# Altium project VM02_hv3.PrjPcb
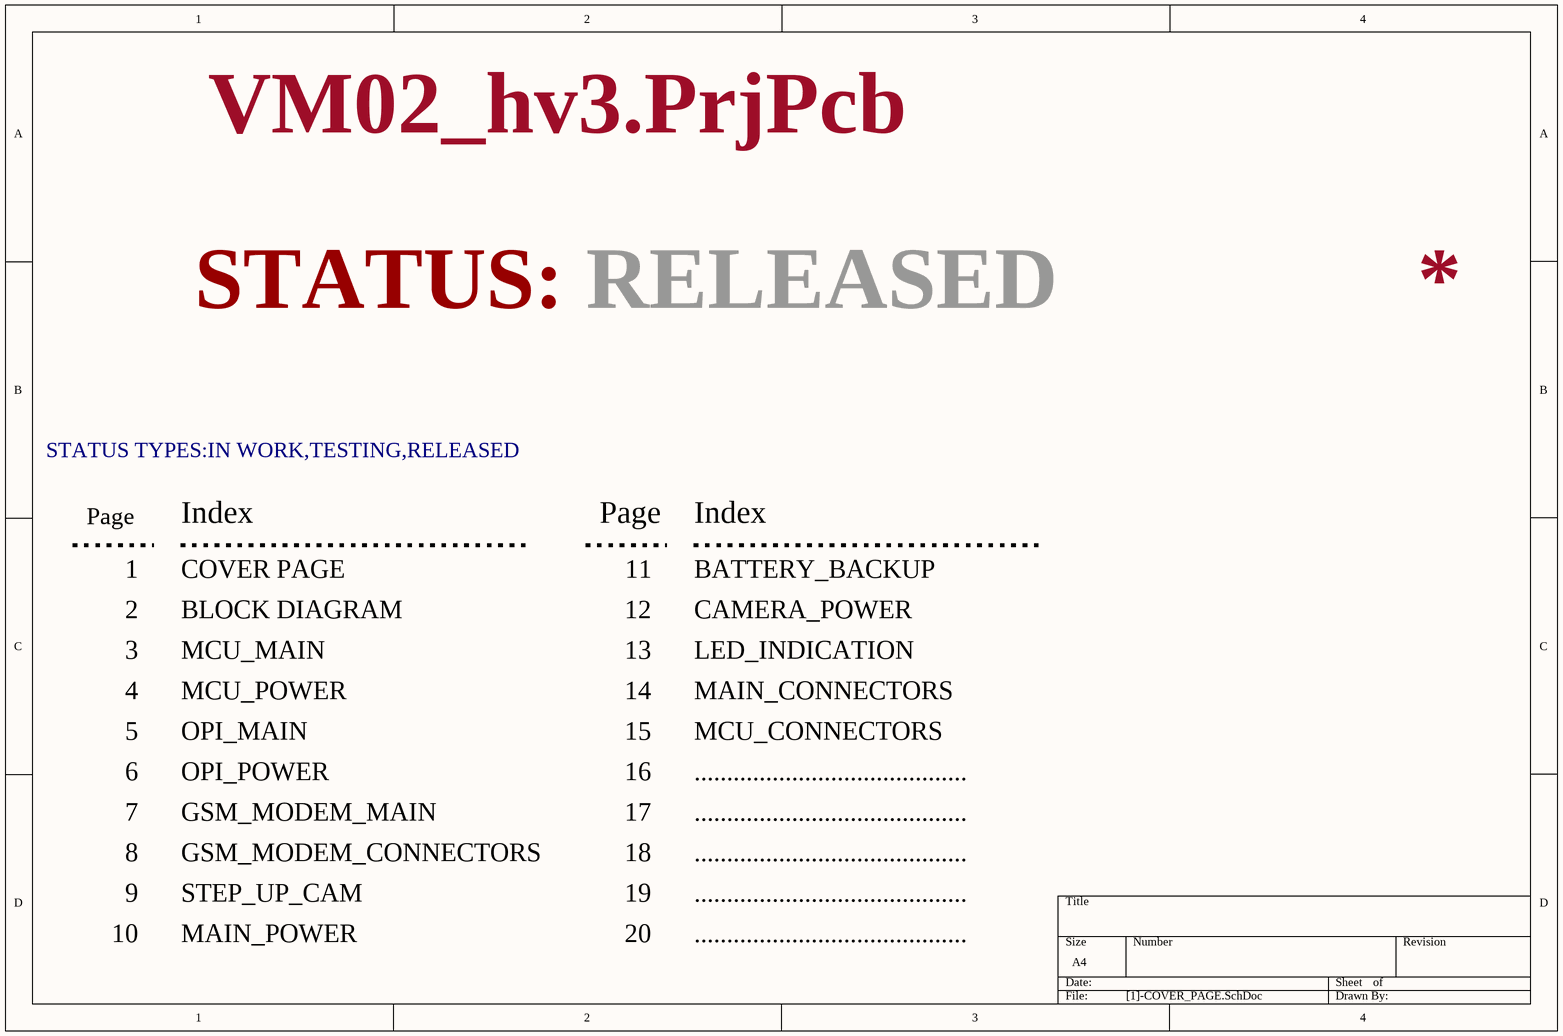
[diagram p0: [1]-COVER_PAGE.SchDoc]
10 sheets, 120 parts. Net scope: flat (ports and power ports of the same name join across sheets).
Board file: VM02_hv3.PcbDoc
Sheets:
  [1]-COVER_PAGE.SchDoc
  [2]-BLOCK_DIAGRAM.SchDoc
  [3]-MCU_MAIN.SchDoc
  [5]-OPI_MAIN.SchDoc
  [6]-OPI_POWER.SchDoc
  [10]-MAIN_POWER.SchDoc
  [12]-MCU_INPUTS.SchDoc
  [13]-LED_INDICATION.SchDoc
  [14]-MAIN_CONNECTORS.SchDoc
  [16]-CLOCK.SchDoc

## Sheet [1]-COVER_PAGE.SchDoc
size A4

### Notes on the sheet
- STATUS:
- RELEASED
- STATUS TYPES:IN WORK,TESTING,RELEASED
- Page
- 1
- Index
- COVER PAGE
- 11
- BATTERY_BACKUP
- 2
- BLOCK DIAGRAM
- 12
- CAMERA_POWER
- 3
- 4
- MCU_MAIN
- MCU_POWER
- 13
- 14
- LED_INDICATION
- MAIN_CONNECTORS
- 5
- 6
- OPI_MAIN
- OPI_POWER
- 15
- 16
- MCU_CONNECTORS
- ..........................................
- 7
- GSM_MODEM_MAIN
- 17
- 8
- 9
- GSM_MODEM_CONNECTORS
- STEP_UP_CAM
- 18
- 19
- 10
- MAIN_POWER
- 20

## Sheet [2]-BLOCK_DIAGRAM.SchDoc
size A4
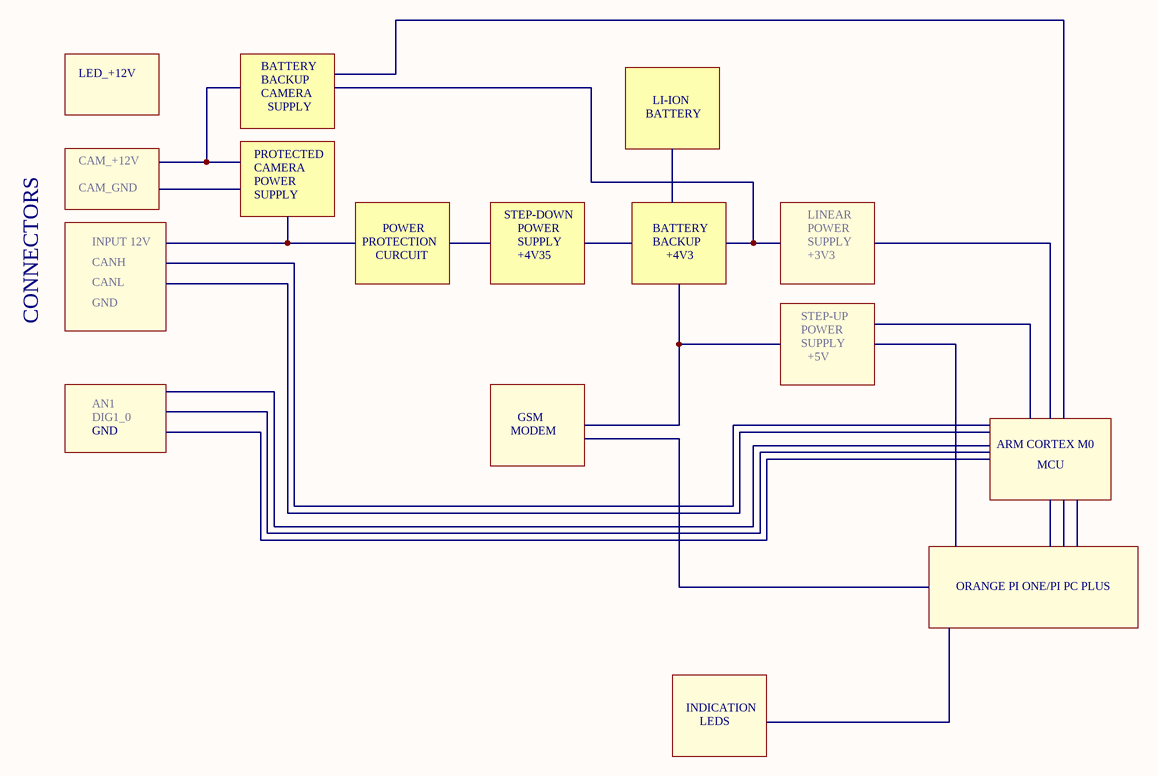
[diagram p1: [2]-BLOCK_DIAGRAM.SchDoc]

### Notes on the sheet
- LED_+12V
- BATTERY
- BACKUP
- CAMERA
- LI-ION
- CAM_+12V
- PROTECTED
- SUPPLY
- CAM_GND
- POWER
- STEP-DOWN
- LINEAR
- INPUT 12V
- CANH
- CANL
- PROTECTION
- CURCUIT
- +4V35
- +4V3
- +3V3
- CONNECTORS
- GND
- STEP-UP
- +5V
- AN1
- DIG1_0
- MODEM
- GSM
- ARM CORTEX M0
- MCU
- ORANGE PI ONE/PI PC PLUS
- INDICATION
- LEDS

## Sheet [3]-MCU_MAIN.SchDoc
size A4
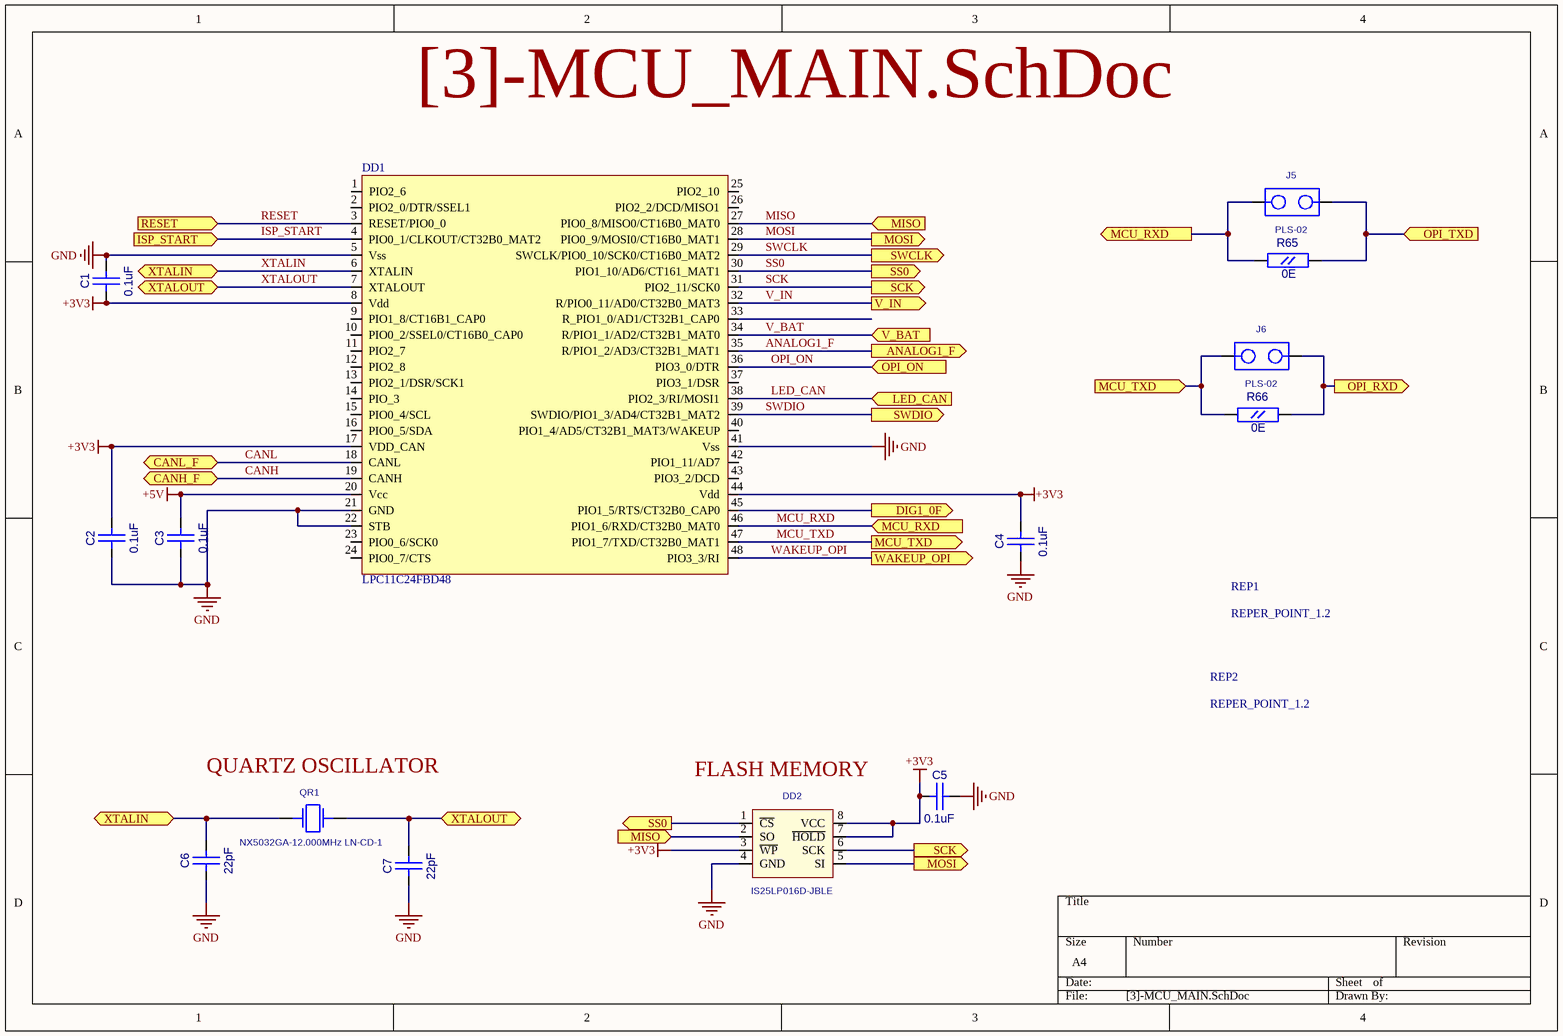
[diagram p2: [3]-MCU_MAIN.SchDoc]

### Parts
C1  0.1uF  [CC0603]
C2  0.1uF  [CC0603]
C3  0.1uF  [CC0603]
C4  0.1uF  [CC0603]
C5  0.1uF  [CC0603]
C6  22pF  [CC0603]
C7  22pF  [CC0603]
DD1  LPC11C24FBD48  [LQFP48]
DD2  IS25LP016D-JBLE  [EIAJ_SO8]
J5  PLS-02  [PLS-02]
J6  PLS-02  [PLS-02]
QR1  NX5032GA-12.000MHz LN-CD-1  [AC5032_2]
R65  0E  [RC0603]
R66  0E  [RC0603]
REP1  REPER_POINT_1.2  [REPER1.2]
REP2  REPER_POINT_1.2  [REPER1.2]

### Ports
ANALOG1_F (out), CANH_F (bidir), CANL_F (bidir), DIG1_0F (out), ISP_START (in), LED_CAN (in), MCU_RXD (in), MCU_RXD (out), MCU_TXD (in), MCU_TXD (out), MISO (in), MOSI (out), OPI_ON (in), OPI_RXD (out), OPI_TXD (in), RESET (in), SCK (out), SS0 (out), SWCLK (out), SWDIO (out), V_BAT (in), V_IN (out), WAKEUP_OPI (out), XTALIN (bidir), XTALOUT (bidir)

### Nets
+3V3: C1.1(A) C2.2(B) C4.2(B) C5.1(A) DD1.8(Vdd) DD1.17(VDD_CAN) DD1.44(Vdd) DD2.3(~{WP}) DD2.7(~{HOLD}) DD2.8(VCC)
+5V: C3.2(B) DD1.20(Vcc)
GND: C1.2(B) C2.1(A) C3.1(A) C4.1(A) C5.2(B) C6.1(A) C7.1(A) DD1.5(Vss) DD1.21(GND) DD1.22(STB) DD1.41(Vss) DD2.4(GND)
ANALOG1_F: DD1.35(R/PIO1_2/AD3/CT32B1_MAT1) ; port ANALOG1_F
CANH: DD1.19(CANH) ; port CANH_F
CANL: DD1.18(CANL) ; port CANL_F
ISP_START: DD1.4(PIO0_1/CLKOUT/CT32B0_MAT2) ; port ISP_START
LED_CAN: DD1.38(PIO2_3/RI/MOSI1) ; port LED_CAN
MCU_RXD: DD1.46(PIO1_6/RXD/CT32B0_MAT0) J5.1 R65.1(A) ; port MCU_RXD
MCU_TXD: DD1.47(PIO1_7/TXD/CT32B0_MAT1) J6.1 R66.1(A) ; port MCU_TXD
MISO: DD1.27(PIO0_8/MISO0/CT16B0_MAT0) DD2.2(SO) ; port MISO
MOSI: DD1.28(PIO0_9/MOSI0/CT16B0_MAT1) DD2.5(SI) ; port MOSI
OPI_ON: DD1.36(PIO3_0/DTR) ; port OPI_ON
RESET: DD1.3(RESET/PIO0_0) ; port RESET
SCK: DD1.31(PIO2_11/SCK0) DD2.6(SCK) ; port SCK
SS0: DD1.30(PIO1_10/AD6/CT161_MAT1) DD2.1(~{CS}) ; port SS0
SWCLK: DD1.29(SWCLK/PIO0_10/SCK0/CT16B0_MAT2) ; port SWCLK
SWDIO: DD1.39(SWDIO/PIO1_3/AD4/CT32B1_MAT2) ; port SWDIO
V_BAT: DD1.34(R/PIO1_1/AD2/CT32B1_MAT0) ; port V_BAT
V_IN: DD1.32(R/PIO0_11/AD0/CT32B0_MAT3) ; port V_IN
WAKEUP_OPI: DD1.48(PIO3_3/RI) ; port WAKEUP_OPI
XTALIN: C6.2(B) DD1.6(XTALIN) QR1.1 ; port XTALIN
XTALOUT: C7.2(B) DD1.7(XTALOUT) QR1.2 ; port XTALOUT
NetC52_2: DD1.45(PIO1_5/RTS/CT32B0_CAP0) ; port DIG1_0F
NetJ5_2: J5.2 R65.2(B) ; port OPI_TXD
NetJ6_2: J6.2 R66.2(B) ; port OPI_RXD

Not connected (* = marked no-connect by the designer): DD1 1(PIO2_6) 2(PIO2_0/DTR/SSEL1) 9(PIO1_8/CT16B1_CAP0) 10(PIO0_2/SSEL0/CT16B0_CAP0) 11(PIO2_7) 12(PIO2_8) 13(PIO2_1/DSR/SCK1) 14(PIO_3) 15(PIO0_4/SCL) 16(PIO0_5/SDA) 23(PIO0_6/SCK0) 24(PIO0_7/CTS) 25(PIO2_10) 26(PIO2_2/DCD/MISO1) 33(R_PIO1_0/AD1/CT32B1_CAP0) 37(PIO3_1/DSR) 40(PIO1_4/AD5/CT32B1_MAT3/WAKEUP) 42(PIO1_11/AD7) 43(PIO3_2/DCD); REP1 1; REP2 1

### Notes on the sheet
- (near QR1) QUARTZ OSCILLATOR
- (near DD2) FLASH MEMORY

### Library data of the parts
C1-C7 = CC0603
  C1-C5: Value: 0.1uF
  C6 C7: Value: 22pF
DD2 = S25FL016A0LMFI01: Value: IS25LP016D-JBLE
QR1 = AC5032_2: AC5032/2; Value: NX5032GA-12.000MHz LN-CD-1
R65 R66 = RC0603: Value: 0E
REP1 REP2 = REPER1.2: Value: REPER_POINT_1.2
DD1 = LPC11C24FBD48: Value: LPC11C24FBD48
J5 J6 = PLS-02: Value: *

## Sheet [5]-OPI_MAIN.SchDoc
size A4
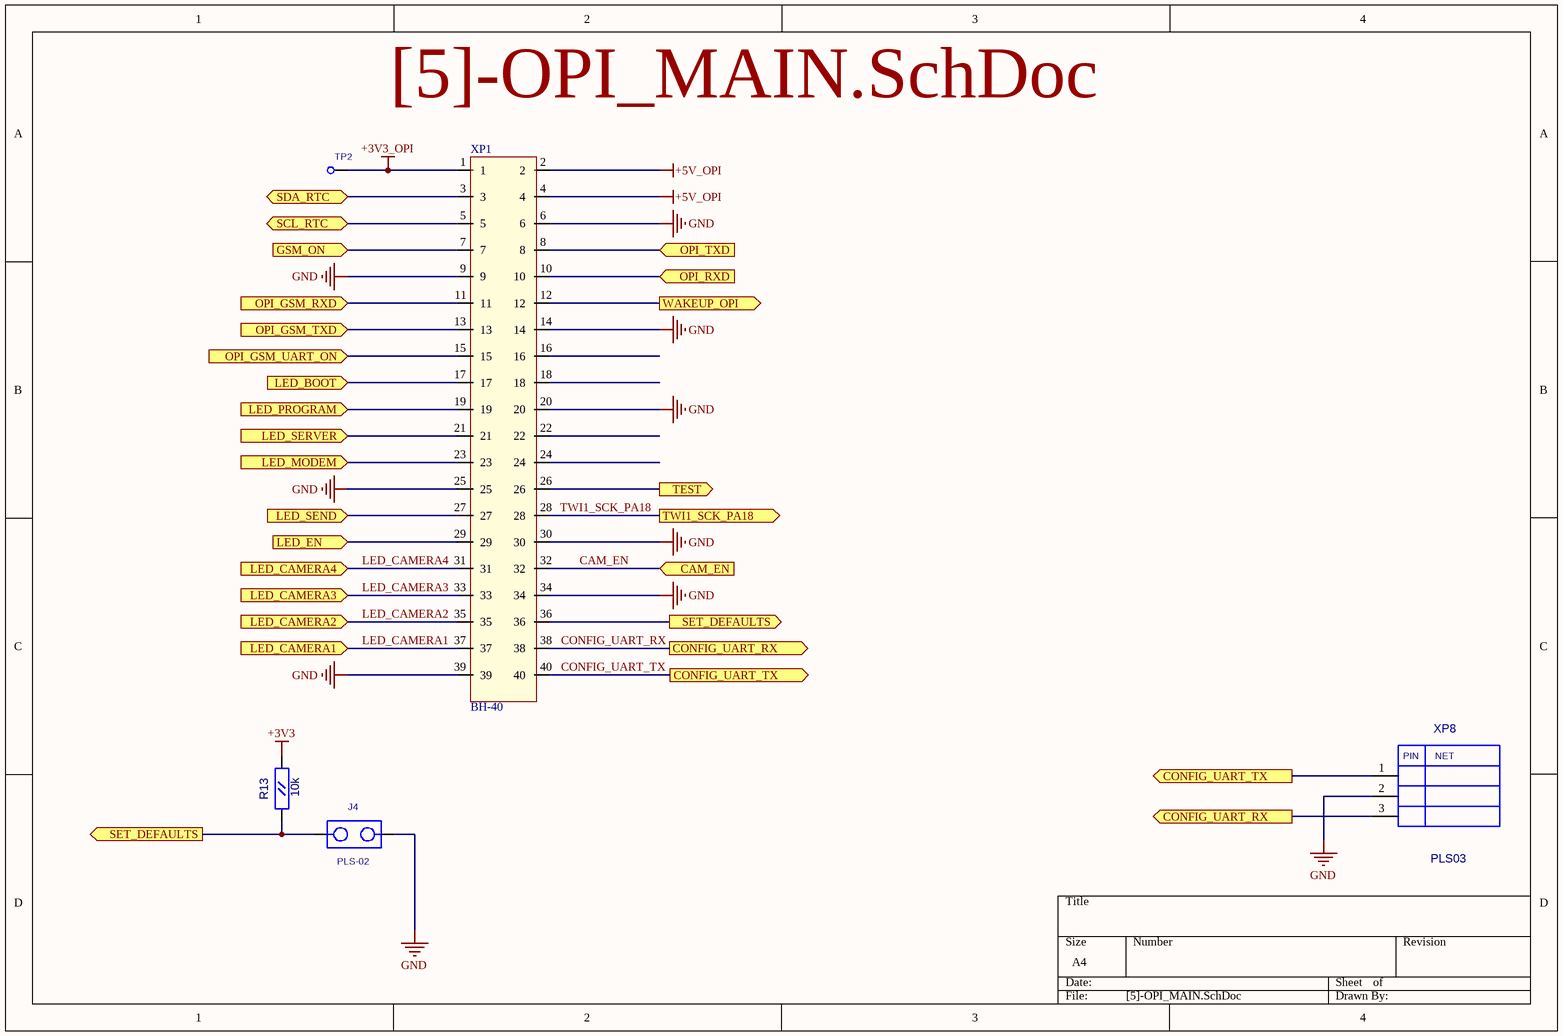
[diagram p3: [5]-OPI_MAIN.SchDoc]

### Parts
J4  PLS-02  [PLS-02]
R13  10k  [RC0603]
TP2  TESTPOINT1  [TESTPOINT1]  (value not drawn)
XP1  BH-40  [BH-40]
XP8  PLS03  [PLS-03]

### Ports
CAM_EN (in), CONFIG_UART_RX (out), CONFIG_UART_TX (out), GSM_ON (in), LED_BOOT (in), LED_CAMERA1 (in), LED_CAMERA2 (in), LED_CAMERA3 (in), LED_CAMERA4 (in), LED_EN (in), LED_MODEM (in), LED_PROGRAM (in), LED_SEND (in), LED_SERVER (in), OPI_GSM_RXD (in), OPI_GSM_TXD (in), OPI_GSM_UART_ON (in), OPI_RXD (in), OPI_TXD (in), SCL_RTC (bidir), SDA_RTC (bidir), SET_DEFAULTS (out), TEST (out), TWI1_SCK_PA18 (out), WAKEUP_OPI (out)

### Nets
+3V3: R13.2(B)
+3V3_OPI: TP2.1 XP1.1
+5V_OPI: XP1.2 XP1.4
GND: J4.2 XP1.6 XP1.9 XP1.14 XP1.20 XP1.25 XP1.30 XP1.34 XP1.39 XP8.2
CAM_EN: XP1.32 ; port CAM_EN
CONFIG_UART_RX: XP1.38 XP8.3 ; port CONFIG_UART_RX
CONFIG_UART_TX: XP1.40 XP8.1 ; port CONFIG_UART_TX
LED_CAMERA1: XP1.37 ; port LED_CAMERA1
LED_CAMERA2: XP1.35 ; port LED_CAMERA2
LED_CAMERA3: XP1.33 ; port LED_CAMERA3
LED_CAMERA4: XP1.31 ; port LED_CAMERA4
TWI1_SCK_PA18: XP1.28 ; port TWI1_SCK_PA18
WAKEUP_OPI: XP1.12 ; port WAKEUP_OPI
NetDD5_5: XP1.3 ; port SDA_RTC
NetDD5_6: XP1.5 ; port SCL_RTC
NetJ4_1: J4.1 R13.1(A) XP1.36 ; port SET_DEFAULTS
NetJ5_2: XP1.8 ; port OPI_TXD
NetJ6_2: XP1.10 ; port OPI_RXD
NetR49_2: XP1.17 ; port LED_BOOT
NetR50_2: XP1.23 ; port LED_MODEM
NetR51_2: XP1.19 ; port LED_PROGRAM
NetR52_2: XP1.21 ; port LED_SERVER
NetR64_2: XP1.27 ; port LED_SEND
NetXP1_7: XP1.7 ; port GSM_ON
NetXP1_11: XP1.11 ; port OPI_GSM_RXD
NetXP1_13: XP1.13 ; port OPI_GSM_TXD
NetXP1_15: XP1.15 ; port OPI_GSM_UART_ON
NetXP1_26: XP1.26 ; port TEST
NetXP1_29: XP1.29 ; port LED_EN

Not connected (* = marked no-connect by the designer): XP1 16 18 22 24

### Notes on the sheet
- (in symbol PLS03) PIN; NET

### Library data of the parts
R13 = RC0603: Value: 10k
XP1 = BH-40: 2.54mm connector with key; Value: BH-40
J4 = PLS-02: Value: *
TP2 = TESTPOINT1: Value: *
XP8 = PLS03: Value: *

## Sheet [6]-OPI_POWER.SchDoc
size A4
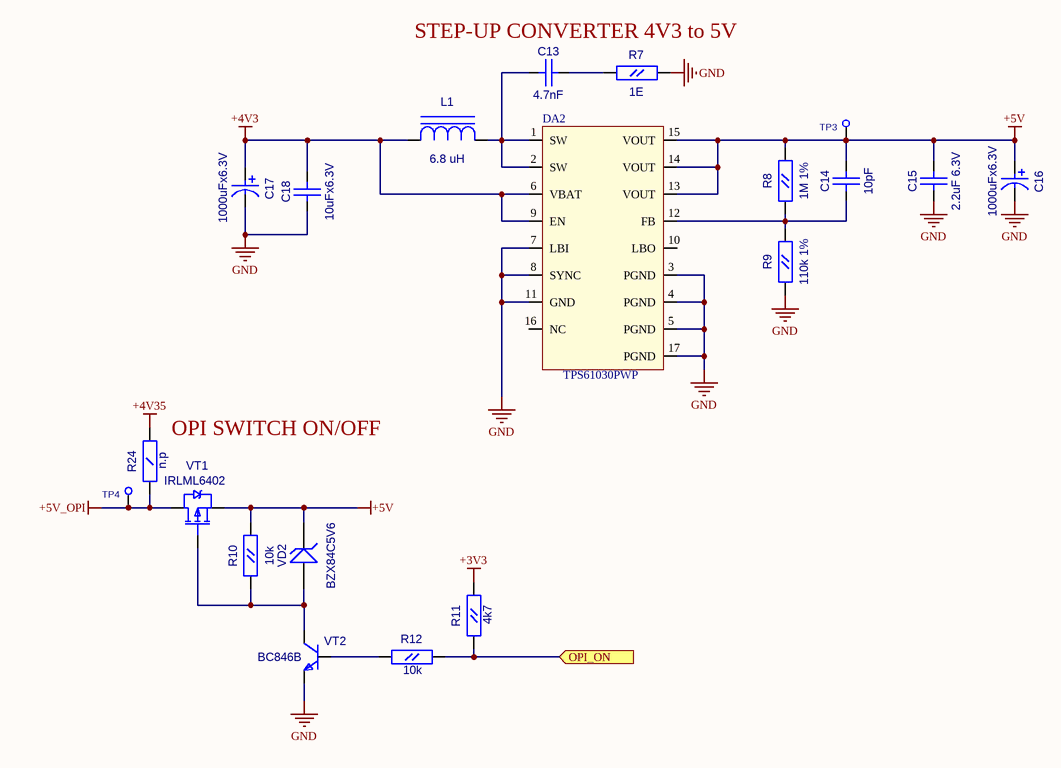
[diagram p4: [6]-OPI_POWER.SchDoc]

### Parts
C13  4.7nF  [CC0603]
C14  10pF  [CC0603]
C15  2.2uF 6.3V  [CC0805]
C16  value 1000uFx6.3V  [CC8X3.5]  (hidden comment: CAP0.35)
C17  value 1000uFx6.3V  [CC8X3.5]  (hidden comment: CAP0.35)
C18  10uFx6.3V  [CC0805]
DA2  TPS61030PWP  [R-PDSO-G16]
L1  6.8 uH  [SDR0805]
R7  1E  [RC0603]
R8  1M 1%  [RC0603]
R9  110k 1%  [RC0603]
R10  10k  [RC0603]
R11  4k7  [RC0603]
R12  10k  [RC0603]
R24  n.p  [RC1206]
TP3  TESTPOINT1  [TESTPOINT1]  (value not drawn)
TP4  TESTPOINT1  [TESTPOINT1]  (value not drawn)
VD2  BZX84C5V6  [SOT-23(123)]
VT1  IRLML6402  [SOT-23(123)]
VT2  BC846B  [SOT-23(123)]

### Ports
OPI_ON (in)

### Nets
+3V3: R11.2(B)
+4V3: C17.1 C18.2(B) DA2.6(VBAT) DA2.9(EN) L1.1(C)
+4V35: R24.2(B)
+5V: C14.2(B) C15.2(B) C16.1 DA2.13(VOUT) DA2.14(VOUT) DA2.15(VOUT) R8.2(B) R10.2(B) TP3.1 VD2.3(K) VT1.2(S)
+5V_OPI: R24.1(A) TP4.1 VT1.3(D)
GND: C15.1(A) C16.2 C17.2 C18.1(A) DA2.3(PGND) DA2.4(PGND) DA2.5(PGND) DA2.7(LBI) DA2.8(SYNC) DA2.11(GND) DA2.17(PGND) R7.2(B) R9.1(A) VT2.2(E)
OPI_ON: R11.1(A) R12.2(B) ; port OPI_ON
NetC13_1: C13.1(A) DA2.1(SW) DA2.2(SW) L1.2(A)
NetC13_2: C13.2(B) R7.1(A)
NetC14_1: C14.1(A) DA2.12(FB) R8.1(A) R9.2(B)
NetR10_1: R10.1(A) VD2.1(A) VT1.1(G) VT2.3(C)
NetR12_1: R12.1(A) VT2.1(B)

Not connected (* = marked no-connect by the designer): DA2 10(LBO) 16(NC)

### Notes on the sheet
- STEP-UP CONVERTER 4V3 to 5V
- (near R24) OPI SWITCH ON/OFF

### Library data of the parts
C13 C14 = CC0603
  C13: Value: 4.7nF
  C14: Value: 10pF
C15 C18 = CC0805
  C15: Value: 2.2uF 6.3V
  C18: Value: 10uFx6.3V
DA2 = TPS61030PWP: Boost converter
L1 = SDR0805: Value: 6.8 uH
R7-R12 = RC0603
  R7: Value: 1E
  R8: Value: 1M 1%
  R9: Value: 110k 1%
  R10 R12: Value: 10k
  R11: Value: 4k7
R24 = RC1206: Value: n.p
VD2 = BZX84: Zener Voltage Regulator Diode; Value: BZX84C5V6
VT1 = IRLML6402: HEXFET Power MOSFET; OriginalName: IRLML5103; ComponentField7: Published 8-Jun-2000; Value: IRLML6402
VT2 = BC846BLT1: ComponentField7: Published 29-Sep-2000; OriginalName: BC846BLT1; Value: BC846B
TP3 TP4 = TESTPOINT1: Value: *

## Sheet [10]-MAIN_POWER.SchDoc
size A4
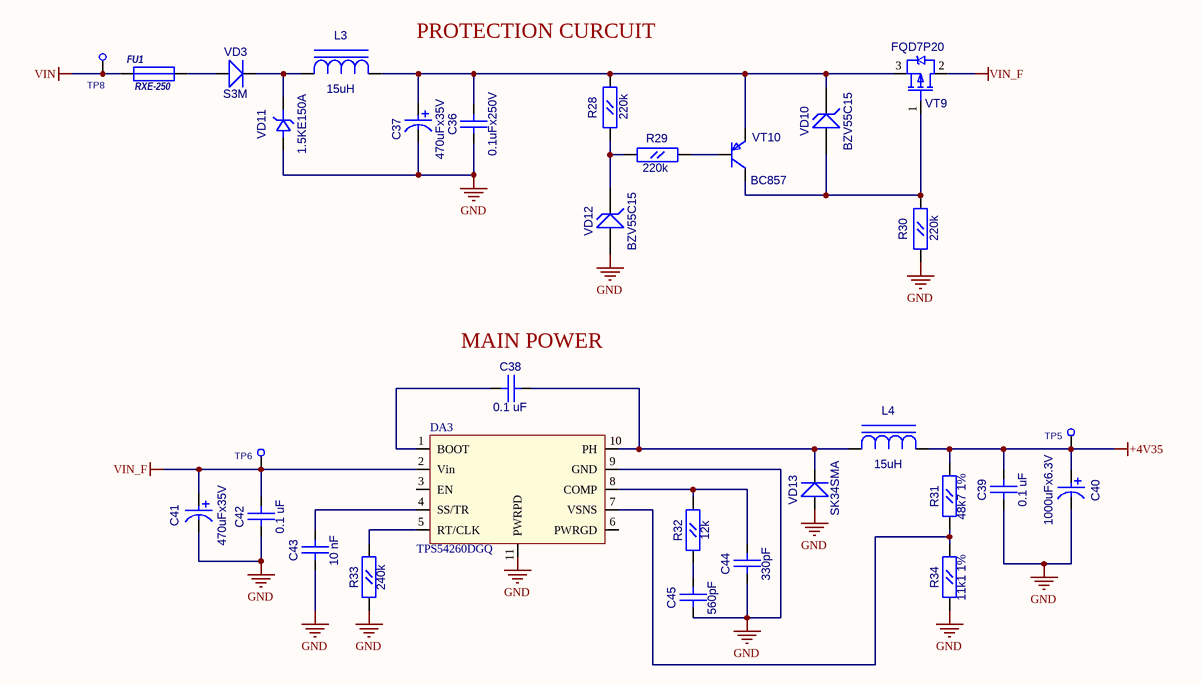
[diagram p5: [10]-MAIN_POWER.SchDoc]

### Parts
C36  0.1uFx250V  [CC1206]
C37  value 470uFx35V  [CC16X10_CAP0.5(1)(Primary)]  (hidden comment: CAP0.5(1))
C38  0.1 uF  [CC0603]
C39  0.1 uF  [CC0603]
C40  1000uFx6.3V  [CC8X3.5]
C41  470uFx35V  [CC16X10_CAP0.5(1)(Primary)]
C42  0.1 uF  [CC0603]
C43  10 nF  [CC0603]
C44  330pF  [CC0603]
C45  560pF  [CC0603]
DA3  TPS54260DGQ  [S-PDSO-G10]
FU1  RXE-250  [RXE-185]
L3  value 15uH  [SDR0805]  (hidden comment: SDR0805)
L4  15uH  [SDR0805]
R28  220k  [RC0603]
R29  220k  [RC0603]
R30  220k  [RC0603]
R31  48k7 1%  [RC0603]
R32  12k  [RC0603]
R33  240k  [RC0603]
R34  11k1 1%  [RC0603]
TP5  TESTPOINT1  [TESTPOINT1]  (value not drawn)
TP6  TESTPOINT1  [TESTPOINT1]  (value not drawn)
TP8  TESTPOINT1  [TESTPOINT1]  (value not drawn)
VD3  S3M  [SMC]
VD10  BZV55C15  [SOD-80]
VD11  1.5KE150A  [DO-201]
VD12  BZV55C15  [SOD-80]
VD13  SK34SMA  [SMA]
VT9  FQD7P20  [D-PAK(TO-252AA)]
VT10  BC857  [SOT-23(123)]

### Nets
+4V35: C39.1(A) C40.1 L4.2(A) R31.2(B) TP5.1
GND: C36.1(A) C37.1 C39.2(B) C40.2 C41.1 C42.2(B) C43.2(B) C44.2(B) C45.2(B) DA3.9(GND) DA3.11(PWRPD) R30.1(A) R33.1(A) R34.1(A) VD11.1(A) VD12.1(A) VD13.1(A)
VIN: FU1.1 TP8.1
VIN_F: C41.2 C42.1(A) DA3.2(Vin) TP6.1 VT9.2(D)
NetC36_2: C36.2(B) C37.2 L3.2(A) R28.2(B) VD10.2 VT9.3(S) VT10.2(E)
NetC38_1: C38.1(A) DA3.10(PH) L4.1(C) VD13.2(K)
NetC38_2: C38.2(B) DA3.1(BOOT)
NetC43_1: C43.1(A) DA3.4(SS/TR)
NetC44_1: C44.1(A) DA3.8(COMP) R32.2(B)
NetC45_1: C45.1(A) R32.1(A)
NetDA3_5: DA3.5(RT/CLK) R33.2(B)
NetDA3_7: DA3.7(VSNS) R31.1(A) R34.2(B)
NetFU1_2: FU1.2 VD3.1(A)
NetL3_1: L3.1(C) VD3.2(K) VD11.2(K)
NetR28_1: R28.1(A) R29.2(B) VD12.2
NetR29_1: R29.1(A) VT10.1(B)
NetR30_2: R30.2(B) VD10.1(A) VT9.1(G) VT10.3(C)

Not connected (* = marked no-connect by the designer): DA3 3(EN) 6(PWRGD)

### Notes on the sheet
- PROTECTION CURCUIT
- (near C38) MAIN POWER

### Library data of the parts
C36 = CC1206: Value: 0.1uFx250V
C38 C39 C42-C45 = CC0603
  C38 C39 C42: Value: 0.1 uF
  C43: Value: 10 nF
  C44: Value: 330pF
  C45: Value: 560pF
C40 = CAP0.35: Value: 1000uFx6.3V
C41 = CAP0.5(1): Value: 470uFx35V
FU1 = RXE-185: Value: *
L4 = SDR0805: Value: 15uH
R28-R34 = RC0603
  R28-R30: Value: 220k
  R31: Value: 48k7 1%
  R32: Value: 12k
  R33: Value: 240k
  R34: Value: 11k1 1%
VD3 = S3A: Schottky Rectifier; Value: S3M
VD10 = BZV55C12: Zener Voltage Regulator Diode; Value: BZV55C15
VD11 = 1.5KE: Value: 1.5KE150A
VD12 = BZV55C12: Zener Voltage Regulator Diode; OriginalName: BXV55C39; ComponentField6: Pin 2 is not connected and not drawn.; ComponentField7: Published 29-Sep-2000; Value: BZV55C15
VD13 = SK34SMA: Schottky Rectifier; Value: {Value}
VT9 = IRFR9220: HEXFET Power MOSFET; OriginalName: IRLML5103; ComponentField7: Published 8-Jun-2000; Value: FQD7P20
VT10 = BC857B: PNP 100ma transistor; OriginalName: BC846BLT1; ComponentField7: Published 29-Sep-2000; Value: BC857
TP5 TP6 TP8 = TESTPOINT1: Value: *

## Sheet [12]-MCU_INPUTS.SchDoc
size A4
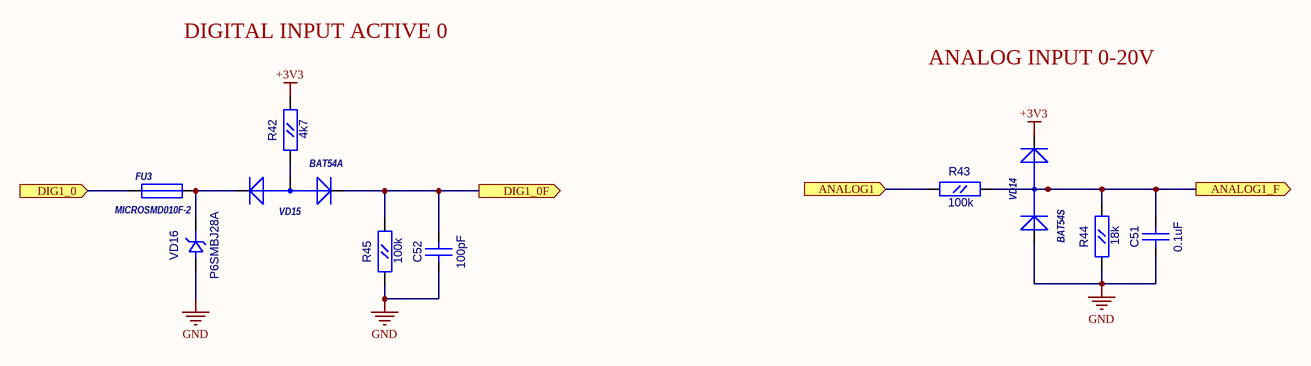
[diagram p6: [12]-MCU_INPUTS.SchDoc]

### Parts
C51  0.1uF  [CC0603]
C52  100pF  [CC0603]
FU3  MICROSMD010F-2  [RC1210]
R42  4k7  [RC0603]
R43  100k  [RC0603]
R44  18k  [RC0603]
R45  100k  [RC0603]
VD14  BAT54S  [SOT-23(GSD)]
VD15  BAT54A  [SOT-23(123)]
VD16  P6SMBJ28A  [SMB]

### Ports
ANALOG1 (in), ANALOG1_F (out), DIG1_0 (in), DIG1_0F (out)

### Nets
+3V3: R42.2(B) VD14.2(K)
GND: C51.1(A) C52.1(A) R44.1(A) R45.1(A) VD14.1(A) VD16.1(A)
ANALOG1_F: C51.2(B) R43.2(B) R44.2(B) VD14.3(AK) ; port ANALOG1_F
NetC52_2: C52.2(B) R45.2(B) VD15.1(K) ; port DIG1_0F
NetFU3_1: FU3.1 ; port DIG1_0
NetFU3_2: FU3.2 VD15.2(K) VD16.2(K)
NetR42_1: R42.1(A) VD15.3(A)
NetR43_1: R43.1(A) ; port ANALOG1

### Notes on the sheet
- DIGITAL INPUT ACTIVE 0
- ANALOG INPUT 0-20V

### Library data of the parts
C51 C52 = CC0603
  C51: Value: 0.1uF
  C52: Value: 100pF
FU3 = MICROSMD: Value: MICROSMD010F-2
R42-R45 = RC0603
  R42: Value: 4k7
  R43 R45: Value: 100k
  R44: Value: 18k
VD14 = BAT54S: 1.0 Ampere General Purpose Rectifier; ComponentField6: Published 8-Jun-2000, Modified 11-July-2000: SIM Model Added.; Value: *
VD15 = BAT54A: 1.0 Ampere General Purpose Rectifier; ComponentField6: Published 8-Jun-2000, Modified 11-July-2000: SIM Model Added.; Value: *
VD16 = SMBJ: Value: P6SMBJ28A

## Sheet [13]-LED_INDICATION.SchDoc
size A4
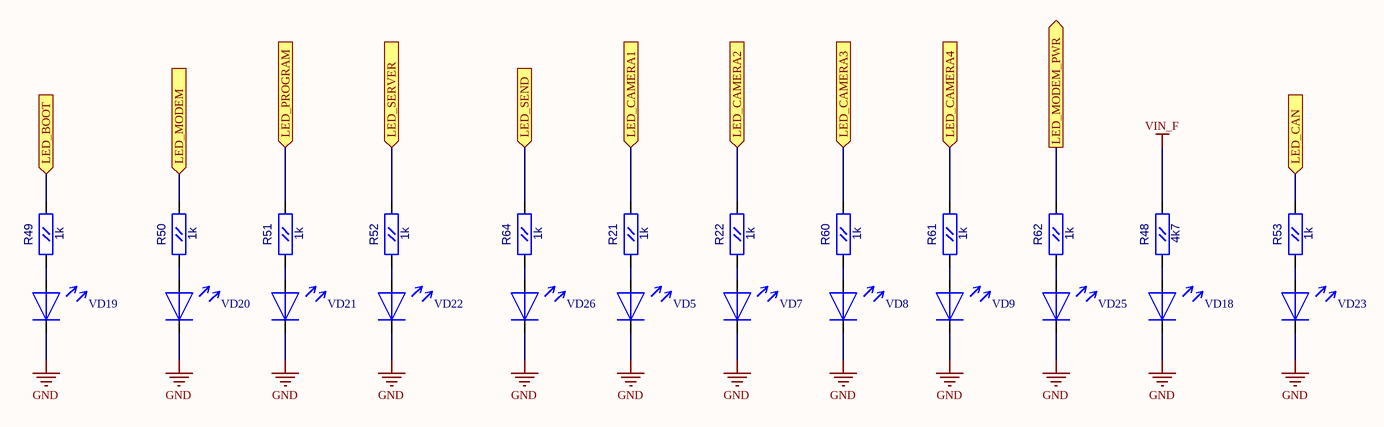
[diagram p7: [13]-LED_INDICATION.SchDoc]

### Parts
R21  1k  [RC0603]
R22  1k  [RC0603]
R48  4k7  [RC0603]
R49  1k  [RC0603]
R50  1k  [RC0603]
R51  1k  [RC0603]
R52  1k  [RC0603]
R53  1k  [RC0603]
R60  1k  [RC0603]
R61  1k  [RC0603]
R62  1k  [RC0603]
R64  1k  [RC0603]
VD5  LED_0805  [LED0805]  (value not drawn)
VD7  LED_0805  [LED0805]  (value not drawn)
VD8  LED_0805  [LED0805]  (value not drawn)
VD9  LED_0805  [LED0805]  (value not drawn)
VD18  LED_0805  [LED0805]  (value not drawn)
VD19  LED_0805  [LED0805]  (value not drawn)
VD20  LED_0805  [LED0805]  (value not drawn)
VD21  LED_0805  [LED0805]  (value not drawn)
VD22  LED_0805  [LED0805]  (value not drawn)
VD23  LED_0805  [LED0805]  (value not drawn)
VD25  LED_0805  [LED0805]  (value not drawn)
VD26  LED_0805  [LED0805]  (value not drawn)

### Ports
LED_BOOT (in), LED_CAMERA1 (in), LED_CAMERA2 (in), LED_CAMERA3 (in), LED_CAMERA4 (in), LED_CAN (in), LED_MODEM (in), LED_MODEM_PWR (out), LED_PROGRAM (in), LED_SEND (in), LED_SERVER (in)

### Nets
GND: VD5.2 VD7.2 VD8.2 VD9.2 VD18.2 VD19.2 VD20.2 VD21.2 VD22.2 VD23.2 VD25.2 VD26.2
VIN_F: R48.2(B)
LED_CAMERA1: R21.2(B) ; port LED_CAMERA1
LED_CAMERA2: R22.2(B) ; port LED_CAMERA2
LED_CAMERA3: R60.2(B) ; port LED_CAMERA3
LED_CAMERA4: R61.2(B) ; port LED_CAMERA4
LED_CAN: R53.2(B) ; port LED_CAN
NetR21_1: R21.1(A) VD5.1
NetR22_1: R22.1(A) VD7.1
NetR48_1: R48.1(A) VD18.1
NetR49_1: R49.1(A) VD19.1
NetR49_2: R49.2(B) ; port LED_BOOT
NetR50_1: R50.1(A) VD20.1
NetR50_2: R50.2(B) ; port LED_MODEM
NetR51_1: R51.1(A) VD21.1
NetR51_2: R51.2(B) ; port LED_PROGRAM
NetR52_1: R52.1(A) VD22.1
NetR52_2: R52.2(B) ; port LED_SERVER
NetR53_1: R53.1(A) VD23.1
NetR60_1: R60.1(A) VD8.1
NetR61_1: R61.1(A) VD9.1
NetR62_1: R62.1(A) VD25.1
NetR62_2: R62.2(B) ; port LED_MODEM_PWR
NetR64_1: R64.1(A) VD26.1
NetR64_2: R64.2(B) ; port LED_SEND

### Library data of the parts
R21 R22 R48-R53 R60-R62 R64 = RC0603
  R21 R22 R49-R53 R60-R62 R64: Value: 1k
  R48: Value: 4k7
VD5 VD7-VD9 VD18-VD23 VD25 VD26 = LED_0805: Value: LED_0805

## Sheet [14]-MAIN_CONNECTORS.SchDoc
size A4
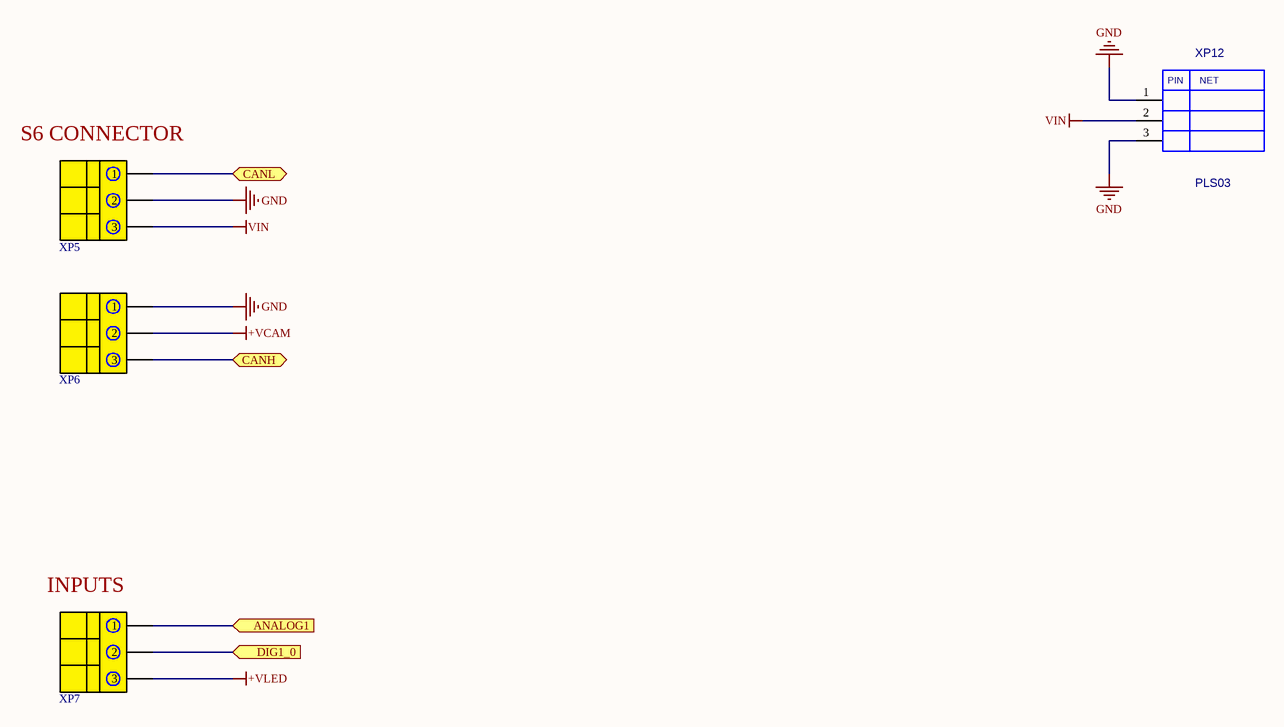
[diagram p8: [14]-MAIN_CONNECTORS.SchDoc]

### Parts
XP5  DG330-3PIN  [DG330-3P]  (value not drawn)
XP6  DG330-3PIN  [DG330-3P]  (value not drawn)
XP7  DG330-3PIN  [DG330-3P]  (value not drawn)
XP12  PLS03  [PLS-03]

### Ports
ANALOG1 (in), CANH (bidir), CANL (bidir), DIG1_0 (in)

### Nets
+VCAM: XP6.2
+VLED: XP7.3
GND: XP5.2 XP6.1 XP12.1 XP12.3
VIN: XP5.3 XP12.2
NetFU3_1: XP7.2 ; port DIG1_0
NetR43_1: XP7.1 ; port ANALOG1
NetXP5_1: XP5.1 ; port CANL
NetXP6_3: XP6.3 ; port CANH

### Notes on the sheet
- (near XP5) S6 CONNECTOR
- (near XP7) INPUTS
- (in symbol PLS03) PIN; NET

### Library data of the parts
XP5-XP7 = DG330-3P: Degson 3 pin connector rear; Value: DG330-3PIN
XP12 = PLS03: Value: *

## Sheet [16]-CLOCK.SchDoc
size A4
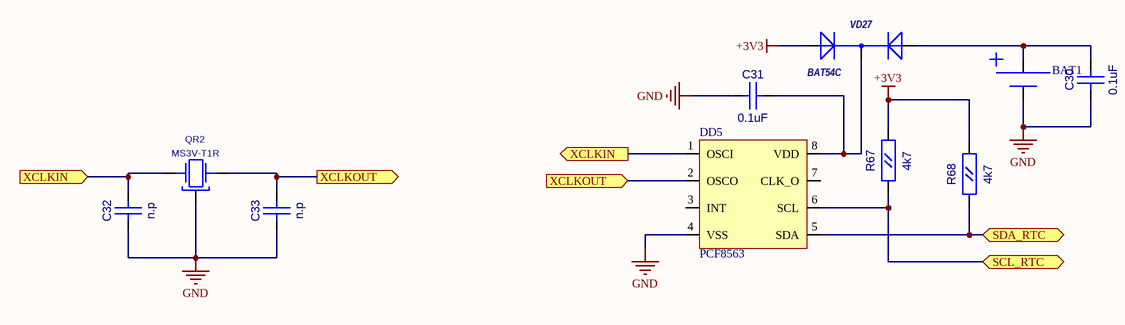
[diagram p9: [16]-CLOCK.SchDoc]

### Parts
BAT1  CR2032-VBY4  [CR2032_ONBOARD]  (value not drawn)
C30  0.1uF  [CC0603]
C31  0.1uF  [CC0603]
C32  n.p  [CC0603]
C33  n.p  [CC0603]
DD5  PCF8563  [SO-8]
QR2  MS3V-T1R  [MS3V-T1R]
R67  4k7  [RC0603]
R68  4k7  [RC0603]
VD27  BAT54C  [SOT-23(123)]

### Ports
SCL_RTC (bidir), SDA_RTC (bidir), XCLKIN (in), XCLKIN (out), XCLKOUT (in), XCLKOUT (out)

### Nets
+3V3: R67.2(B) R68.2(B) VD27.1(A)
GND: BAT1.1 C30.1(A) C31.1(A) C32.1(A) C33.1(A) DD5.4(VSS) QR2.3
NetBAT1_2: BAT1.2 C30.2(B) VD27.2(A)
NetC31_2: C31.2(B) DD5.8(VDD) VD27.3(K)
NetC32_2: C32.2(B) DD5.1(OSCI) QR2.2(X2) ; port XCLKIN
NetC33_2: C33.2(B) DD5.2(OSCO) QR2.1(X1) ; port XCLKOUT
NetDD5_5: DD5.5(SDA) R68.1(A) ; port SDA_RTC
NetDD5_6: DD5.6(SCL) R67.1(A) ; port SCL_RTC

Not connected (* = marked no-connect by the designer): DD5 3(INT) 7(CLK_O)

### Library data of the parts
BAT1 = CR2032-VBY2: Value: CR2032-VBY4
C30-C33 = CC0603
  C30 C31: Value: 0.1uF
  C32 C33: Value: n.p
QR2 = MS3V-T1R: CRYSTAL_32768 Hz; Value: MS3V-T1R
R67 R68 = RC0603: Value: 4k7
DD5 = PCF8563: Value: PCF8563
VD27 = BAT54C: Value: *

## Nets that join several sheets
+3V3: [3]-MCU_MAIN (10 pins), [5]-OPI_MAIN (R13.2), [6]-OPI_POWER (R11.2), [12]-MCU_INPUTS (R42.2 VD14.2), [16]-CLOCK (R67.2 R68.2 VD27.1)
+4V35: [6]-OPI_POWER (R24.2), [10]-MAIN_POWER (5 pins)
+5V: [3]-MCU_MAIN (C3.2 DD1.20), [6]-OPI_POWER (11 pins)
+5V_OPI: [5]-OPI_MAIN (XP1.2 XP1.4), [6]-OPI_POWER (R24.1 TP4.1 VT1.3)
GND: [3]-MCU_MAIN (12 pins), [5]-OPI_MAIN (10 pins), [6]-OPI_POWER (14 pins), [10]-MAIN_POWER (17 pins), [12]-MCU_INPUTS (6 pins), [13]-LED_INDICATION (12 pins), [14]-MAIN_CONNECTORS (XP5.2 XP6.1 XP12.1 XP12.3), [16]-CLOCK (7 pins)
VIN: [10]-MAIN_POWER (FU1.1 TP8.1), [14]-MAIN_CONNECTORS (XP5.3 XP12.2)
VIN_F: [10]-MAIN_POWER (5 pins), [13]-LED_INDICATION (R48.2)
ANALOG1_F: [3]-MCU_MAIN (DD1.35), [12]-MCU_INPUTS (C51.2 R43.2 R44.2 VD14.3)
LED_CAMERA1: [5]-OPI_MAIN (XP1.37), [13]-LED_INDICATION (R21.2)
LED_CAMERA2: [5]-OPI_MAIN (XP1.35), [13]-LED_INDICATION (R22.2)
LED_CAMERA3: [5]-OPI_MAIN (XP1.33), [13]-LED_INDICATION (R60.2)
LED_CAMERA4: [5]-OPI_MAIN (XP1.31), [13]-LED_INDICATION (R61.2)
LED_CAN: [3]-MCU_MAIN (DD1.38), [13]-LED_INDICATION (R53.2)
NetC52_2: [3]-MCU_MAIN (DD1.45), [12]-MCU_INPUTS (C52.2 R45.2 VD15.1)
NetDD5_5: [5]-OPI_MAIN (XP1.3), [16]-CLOCK (DD5.5 R68.1)
NetDD5_6: [5]-OPI_MAIN (XP1.5), [16]-CLOCK (DD5.6 R67.1)
NetFU3_1: [12]-MCU_INPUTS (FU3.1), [14]-MAIN_CONNECTORS (XP7.2)
NetJ5_2: [3]-MCU_MAIN (J5.2 R65.2), [5]-OPI_MAIN (XP1.8)
NetJ6_2: [3]-MCU_MAIN (J6.2 R66.2), [5]-OPI_MAIN (XP1.10)
NetR43_1: [12]-MCU_INPUTS (R43.1), [14]-MAIN_CONNECTORS (XP7.1)
NetR49_2: [5]-OPI_MAIN (XP1.17), [13]-LED_INDICATION (R49.2)
NetR50_2: [5]-OPI_MAIN (XP1.23), [13]-LED_INDICATION (R50.2)
NetR51_2: [5]-OPI_MAIN (XP1.19), [13]-LED_INDICATION (R51.2)
NetR52_2: [5]-OPI_MAIN (XP1.21), [13]-LED_INDICATION (R52.2)
NetR64_2: [5]-OPI_MAIN (XP1.27), [13]-LED_INDICATION (R64.2)
OPI_ON: [3]-MCU_MAIN (DD1.36), [6]-OPI_POWER (R11.1 R12.2)
WAKEUP_OPI: [3]-MCU_MAIN (DD1.48), [5]-OPI_MAIN (XP1.12)